# Altium schematic sheet BrauV2_Etherent.SchDoc
size 420 x 297 mm; PageSetup: Record=PageOptions|CenterHorizontal=True|CenterVertical=True|PrintScale=1.01|XCorrection=1.00|YCorrection=1.00|PrintKind=1|BorderSize=5000000|LeftOffset=0|BottomOffset=0|Orientation=2|PaperLength=1000|PaperWidth=1000|Scale=100|PaperSource=7|PrintQuality=-4|MediaType=1|DitherType=10|PaperKind=A3|PrintScaleMode=1; DocumentNumber: 9; SheetNumber: 9; SheetTotal: 22
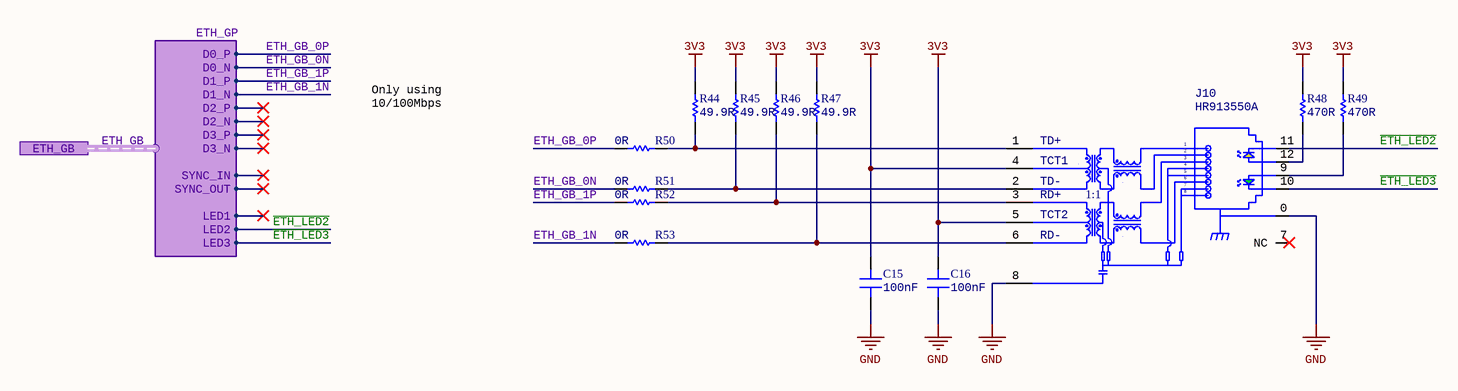
[diagram p0: BrauV2_Etherent.SchDoc]

## Parts
C15  Capacitance: 100nF  [SMD_CAP_0402(1005)_N]  (hidden comment: CC0402KRX5R9BB104)
C16  Capacitance: 100nF  [SMD_CAP_0402(1005)_N]  (hidden comment: CC0402KRX5R9BB104)
J10  HR913550A  [HR913550A]
R44  Resistance: 49.9R  [SMD_RES_0402(1005)_N]  (hidden comment: RC0402FR-0749R9L)
R45  Resistance: 49.9R  [SMD_RES_0402(1005)_N]  (hidden comment: RC0402FR-0749R9L)
R46  Resistance: 49.9R  [SMD_RES_0402(1005)_N]  (hidden comment: RC0402FR-0749R9L)
R47  Resistance: 49.9R  [SMD_RES_0402(1005)_N]  (hidden comment: RC0402FR-0749R9L)
R48  Resistance: 470R  [SMD_RES_0402(1005)_N]  (hidden comment: RC0402FR-07470RL)
R49  Resistance: 470R  [SMD_RES_0402(1005)_N]  (hidden comment: RC0402FR-07470RL)
R50  Resistance: 0R  [SMD_RES_0402(1005)_N]  (hidden comment: RC0402FR-070RL)
R51  Resistance: 0R  [SMD_RES_0402(1005)_N]  (hidden comment: RC0402FR-070RL)
R52  Resistance: 0R  [SMD_RES_0402(1005)_N]  (hidden comment: RC0402FR-070RL)
R53  Resistance: 0R  [SMD_RES_0402(1005)_N]  (hidden comment: RC0402FR-070RL)

## Ports
ETH_GB (harness ETH_GP)

## Harnesses
ETH_GP: D0_P, D0_N, D1_P, D1_N, D2_P, D2_N, D3_P, D3_N, SYNC_IN, SYNC_OUT, LED1, LED2, LED3

## Nets
3V3: C15.2 C16.2 J10.4(TCT1) J10.5(TCT2) R44.2 R45.2 R46.2 R47.2 R48.2 R49.2
GND: C15.1 C16.1 J10.0(SHLD) J10.8(GND)
~{ETH_LED2}: J10.11(YLED-) ; port ETH_GB.LED2
~{ETH_LED3}: J10.10(GLED+) ; port ETH_GB.LED3
ETH_GB_0N: R51.1 ; port ETH_GB.D0_N  [project net ETH_GB.D0_N]
ETH_GB_0P: R50.1 ; port ETH_GB.D0_P  [project net ETH_GB.D0_P]
ETH_GB_1N: R53.1 ; port ETH_GB.D1_N  [project net ETH_GB.D1_N]
ETH_GB_1P: R52.1 ; port ETH_GB.D1_P  [project net ETH_GB.D1_P]
NetJ10_1: J10.1(TD+) R44.1 R50.2
NetJ10_2: J10.2(TD-) R45.1 R51.2
NetJ10_3: J10.3(RD+) R46.1 R52.2
NetJ10_6: J10.6(RD-) R47.1 R53.2
NetJ10_9: J10.9(OLED+) R49.1
NetJ10_12: J10.12(YLED+) R48.1

Not connected (* = marked no-connect by the designer): J10 7(NC)*

## Buses and harness runs
harness ETH_GB = port ETH_GB

## Notes on the sheet
- Only using 10/100Mbps
- FILE NAME
- PROJECT
- TITLE
- REV
- AUTHOR
- SIZE
- SHEET
- DATE
- OF
- A3
- (in symbol HR913550A) 1:1

## Library data of the parts
C15 C16 = 100nF 0402 50V 10%: 100nF ±10% 50V X5R 0402 Multilayer Ceramic Capacitors MLCC - SMD/SMT RoHS; Package: 0402; Tolerance: 10%; Voltage Rating: 50V
J10 = HR913550A: RJ45 12 1 Green - Yellow Through Hole Ethernet Connectors/Modular Connectors (RJ45 RJ11) RoHS
R44-R47 = 49R9 0402 1% 1/16W: 49.9Ω ±1% 1/16W ±100ppm/℃ 0402 Chip Resistor - Surface Mount RoHS; Package: 0402; Tolerance: 1%; Power Rating: 1/16W
R48 R49 = 470R 0402 1% 1W: 470Ω ±1% 1/16W ±100ppm/℃ 0402 Chip Resistor - Surface Mount RoHS; Power Rating: 1W; Package: 0402; Tolerance: 1%
R50-R53 = 0R 0402 1% 1/16W: 0Ω ±1% 1/16W 0402 Chip Resistor - Surface Mount RoHS; Package: 0402; Tolerance: 1%; Power Rating: 1/16W